# EAGLE design paste_injectorMM (EAGLE 6.5.0)
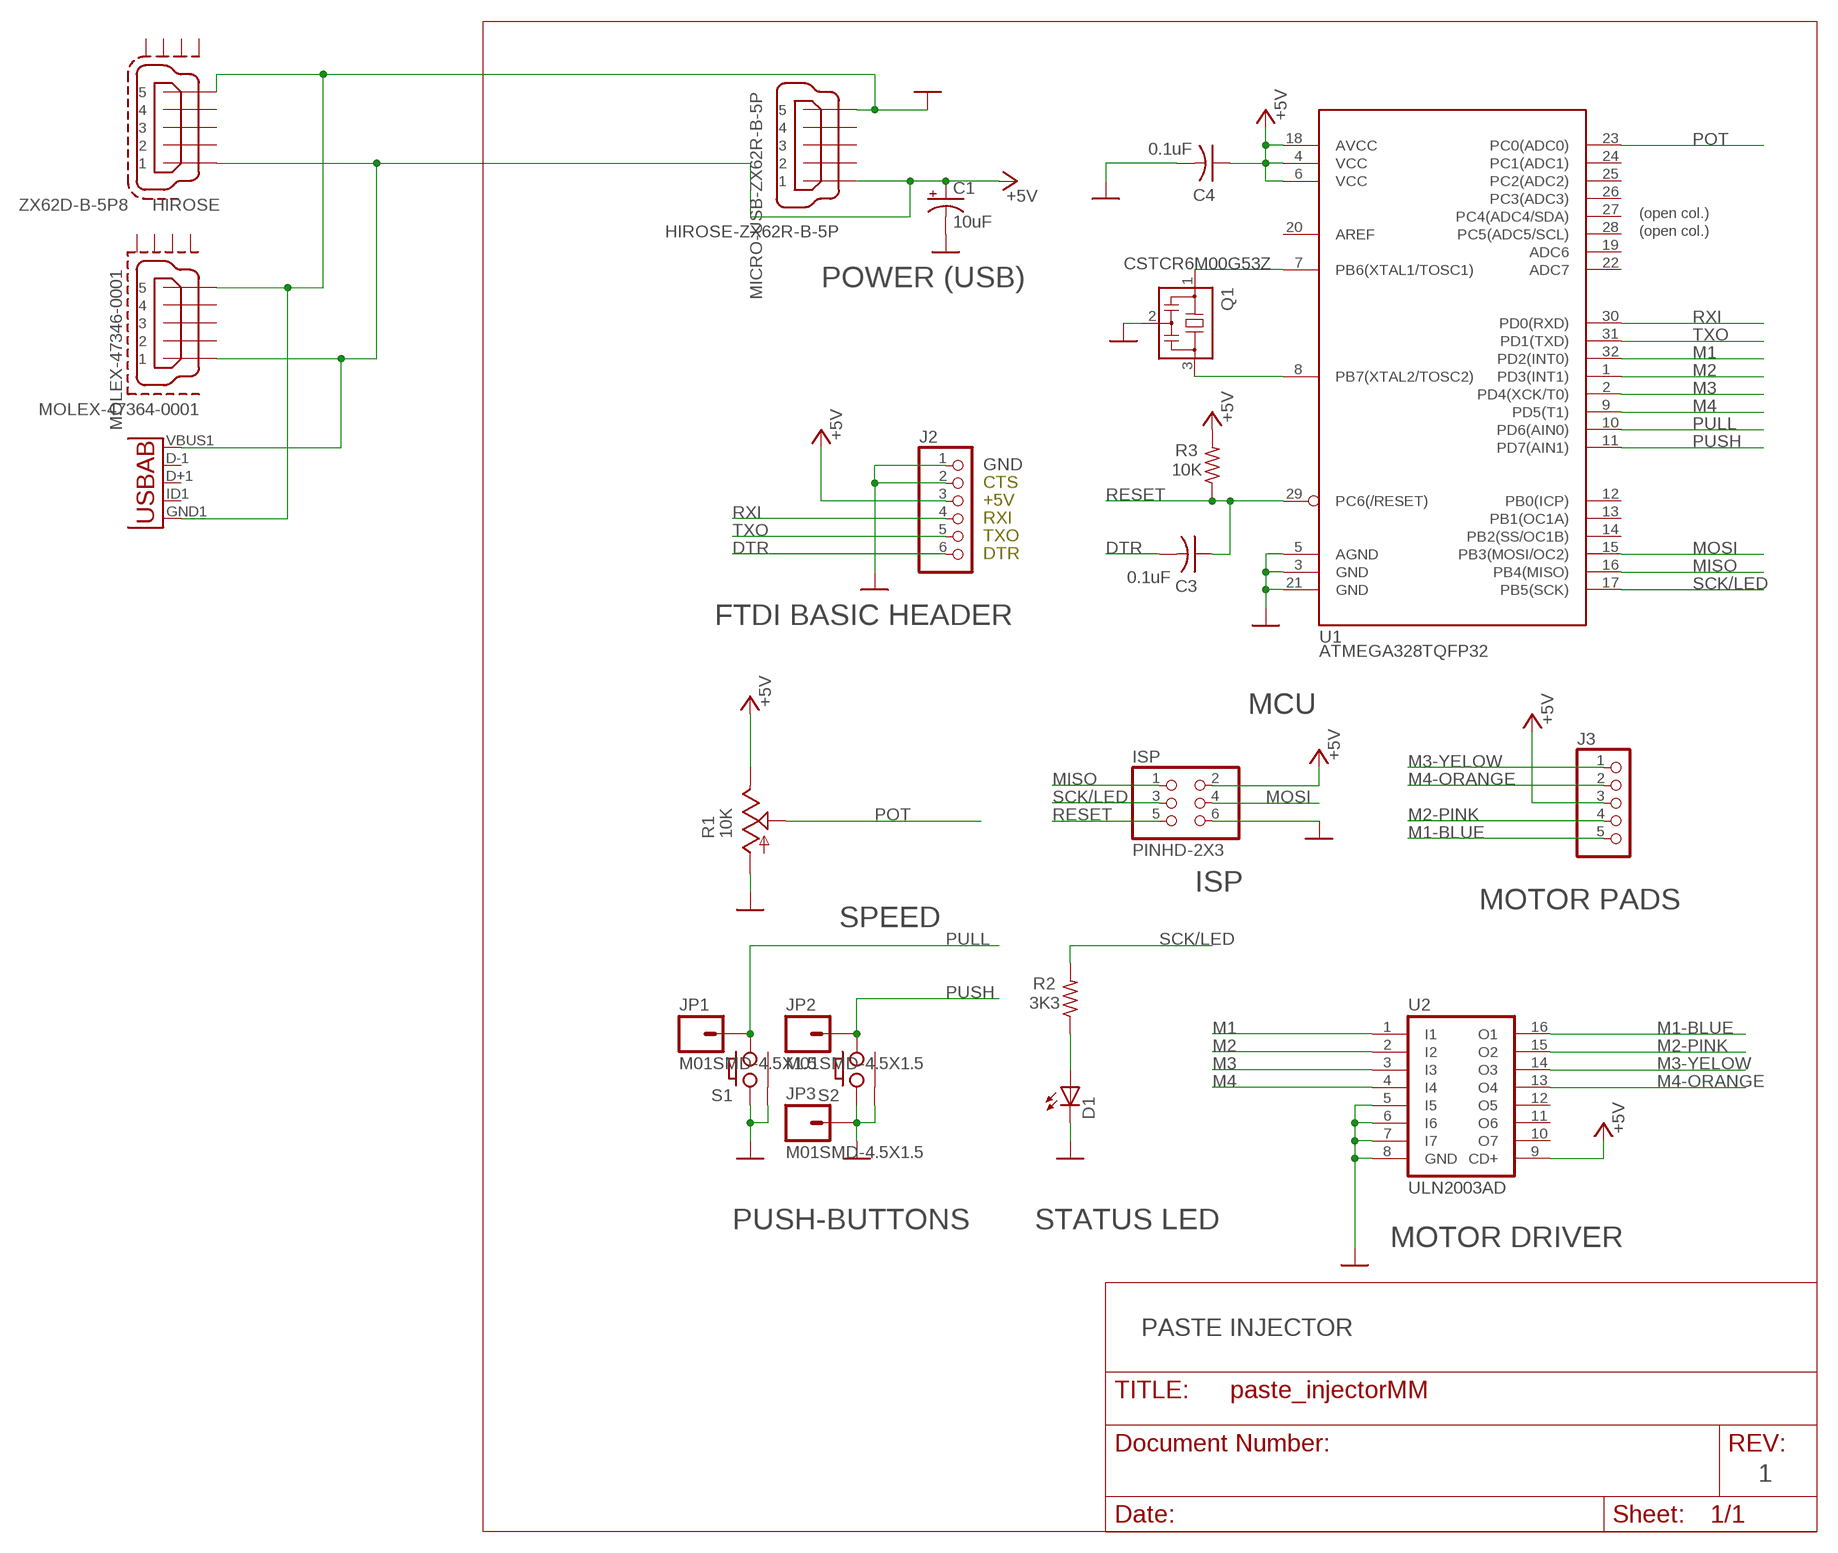
[diagram p0: schematic, sheet 1]

## Parts
C1  10uF  CPOL-USA/3216-18R  [A/3216-18R]
C3  0.1uF  CAP-C0603  [C0603]
C4  0.1uF  CAP-C0603  [C0603]
D1  LED  [LED0603]
HIROSE  ZX62D-B-5P8  [ZX62D-B-5P8]
HIROSE-ZX62R-B-5P  MICRO-USB-ZX62R-B-5P  [ZX62R-B-5P]
ISP  PINHD-2X3  [2X03]
J2  PINHD-1X6  [1X06]
J3  PINHD-1X5  [1X05]
JP1  M01SMD-4.5X1.5  [PAD-1.5X4.5]
JP2  M01SMD-4.5X1.5  [PAD-1.5X4.5]
JP3  M01SMD-4.5X1.5  [PAD-1.5X4.5]
MOLEX-47364-0001  MOLEX-47346-0001  [MOLEX-47364-0001]
Q1  CSTCR6M00G53Z  [CSTCR6M]
R1  10K  TRIMPOTCA9V  [TRIMPOT]
R2  3K3  RES-R0603  [R0603]
R3  10K  RES-R0603  [R0603]
S1  PUSH_BUTTON  [PUSH_BUTTON]
S2  PUSH_BUTTON  [PUSH_BUTTON]
U1  ATMEGA328TQFP32  [TQFP32-08]
U2  ULN2003AD  [SO16]
U$7  USB-AB""  [USB-AB-MICRO-SMD_V02_BOSS]

## Nets
+5V [power]: C1.+ C4.1 HIROSE-ZX62R-B-5P.1 HIROSE.P$1 ISP.2 J2.3 J3.3 MOLEX-47364-0001.1 R1.CW R3.2 U1.4(VCC) U1.6(VCC) U1.18(AVCC) U2.9(CD+) U$7.VBUS1(VBUS)
DTR: C3.2 J2.6
GND [power]: C1.- C4.2 D1.C HIROSE-ZX62R-B-5P.5 HIROSE.P$5 ISP.6 J2.1 J2.2 JP3.P$1 MOLEX-47364-0001.5 Q1.2 R1.CCW S1.A1 S1.GND S2.A1 S2.GND U1.3(GND) U1.5(AGND) U1.21(GND) U2.5(I5) U2.6(I6) U2.7(I7) U2.8(GND) U$7.GND1(GND)
M1: U1.32(PD2(INT0)) U2.1(I1)
M1-BLUE: J3.5 U2.16(O1)
M2: U1.1(PD3(INT1)) U2.2(I2)
M2-PINK: J3.4 U2.15(O2)
M3: U1.2(PD4(XCK/T0)) U2.3(I3)
M3-YELOW: J3.1 U2.14(O3)
M4: U1.9(PD5(T1)) U2.4(I4)
M4-ORANGE: J3.2 U2.13(O4)
MISO: ISP.1 U1.16(PB4(MISO))
MOSI: ISP.4 U1.15(PB3(MOSI/OC2))
N$1: D1.A R2.1
N$2: Q1.1 U1.7(PB6(XTAL1/TOSC1))
N$7: Q1.3 U1.8(PB7(XTAL2/TOSC2))
POT: R1.C U1.23(PC0(ADC0))
PULL: JP1.P$1 S1.B1 U1.10(PD6(AIN0))
PUSH: JP2.P$1 S2.B1 U1.11(PD7(AIN1))
RESET: C3.1 ISP.5 R3.1 U1.29(PC6(/RESET))
RXI: J2.4 U1.30(PD0(RXD))
SCK/LED: ISP.3 R2.2 U1.17(PB5(SCK))
TXO: J2.5 U1.31(PD1(TXD))
Unconnected: HIROSE-ZX62R-B-5P.2 HIROSE-ZX62R-B-5P.3 HIROSE-ZX62R-B-5P.4 HIROSE.P$2 HIROSE.P$3 HIROSE.P$4 HIROSE.SH1 HIROSE.SH2 HIROSE.SH3 HIROSE.SH4 MOLEX-47364-0001.2 MOLEX-47364-0001.3 MOLEX-47364-0001.4 MOLEX-47364-0001.GND1 MOLEX-47364-0001.GND2 MOLEX-47364-0001.GND3 MOLEX-47364-0001.GND4 U1.12(PB0(ICP)) U1.13(PB1(OC1A)) U1.14(PB2(SS/OC1B)) U1.19(ADC6) U1.20(AREF) U1.22(ADC7) U1.24(PC1(ADC1)) U1.25(PC2(ADC2)) U1.26(PC3(ADC3)) U1.27(PC4(ADC4/SDA)) U1.28(PC5(ADC5/SCL)) U2.10(O7) U2.11(O6) U2.12(O5) U$7.D+1(D+) U$7.D-1(D-) U$7.ID1(USBID)

## Notes on the sheet
- (open col.)
- (open col.)
- POWER (USB)
- GND
- CTS
- +5V
- RXI
- TXO
- DTR
- FTDI BASIC HEADER
- MCU
- ISP
- MOTOR PADS
- SPEED
- PUSH-BUTTONS | STATUS LED
- MOTOR DRIVER
- PASTE INJECTOR
- 1

## Library data of the parts
C1 = paste_injector:CPOL-US
C3 C4 = paste_injector:CAP-: CAPACITOR, American symbol
D1 = paste_injector:LED
HIROSE = j_usb_hirose_zx62d-b-5p8:ZX62D-B-5P8: Hirose ZX62D-B-5P8 Micro-B USB connector, standard mount location, with through-hold shell tabs and SMD pins.
HIROSE-ZX62R-B-5P = hirose-con:MICRO-USB-: Hirose Micro USB Connector ZX62R-B-5P: Micro B, reverse (top mount) shell SMT Supplier: DigiKey H11574CT-ND Source: http://www.hirose.co.jp/cataloge_hp/e24200011.pdf
ISP = paste_injector:PINHD-2X3
J2 = paste_injector:PINHD-1X6: PIN HEADER
J3 = paste_injector:PINHD-1X5: PIN HEADER
JP1-JP3 = SparkFun-Connectors:M01: Header 1 Standard 1-pin 0.1" header. Use with straight break away headers (SKU : PRT-00116), right angle break away headers (PRT-00553), swiss pins (PRT-00743), machine pins (PRT-00117), and female headers (PRT-00115).
MOLEX-47364-0001 = usb_con-update:MOLEX-47346-0001: MICRO USB B, BOTTOM MOUNT
Q1 = paste_injector:CSTCR: Resonator Source: murata.co.jp; MPN: CSTCR6M00G53-R0; OC_FARNELL: 1170434; OC_NEWARK: 25M8759
R1 = paste_injector:TRIMPOT: POTENTIOMETER
R2 R3 = paste_injector:RES-: RESISTOR, American symbol
S1 S2 = paste_injector:PUSH_BUTTON
U1 = paste_injector:ATMEGA328
U2 = paste_injector:ULN2003A: DRIVER ARRAY
U$7 = Testing:USB-AB: This is a USB AB connector that is compatible with USB OTG. i.e. this connector can serve as a host or device

## Net classes
1 power: width 0.305 mm

## Board
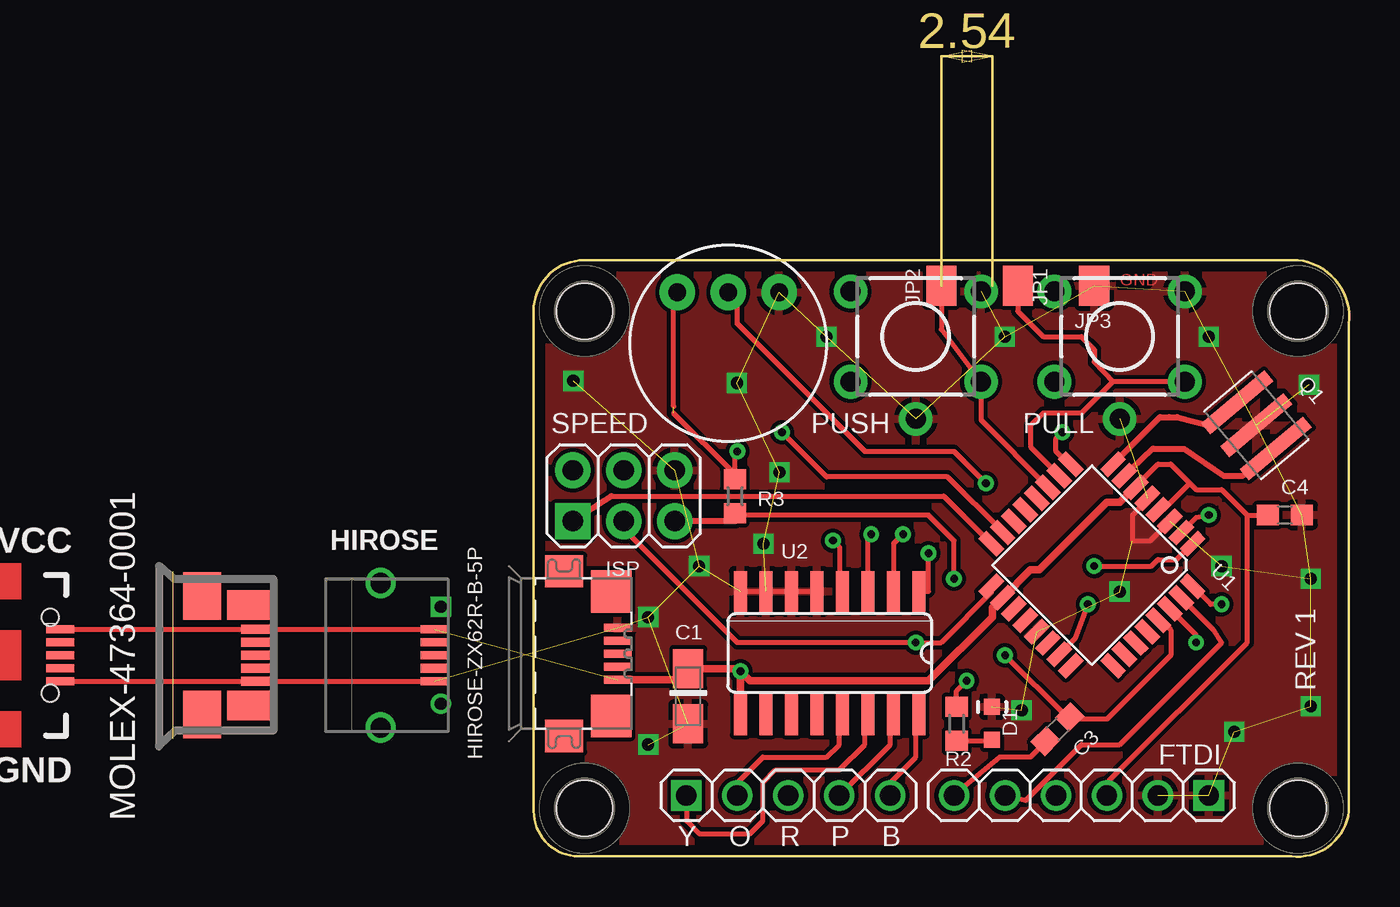
[diagram p1: board, top side]
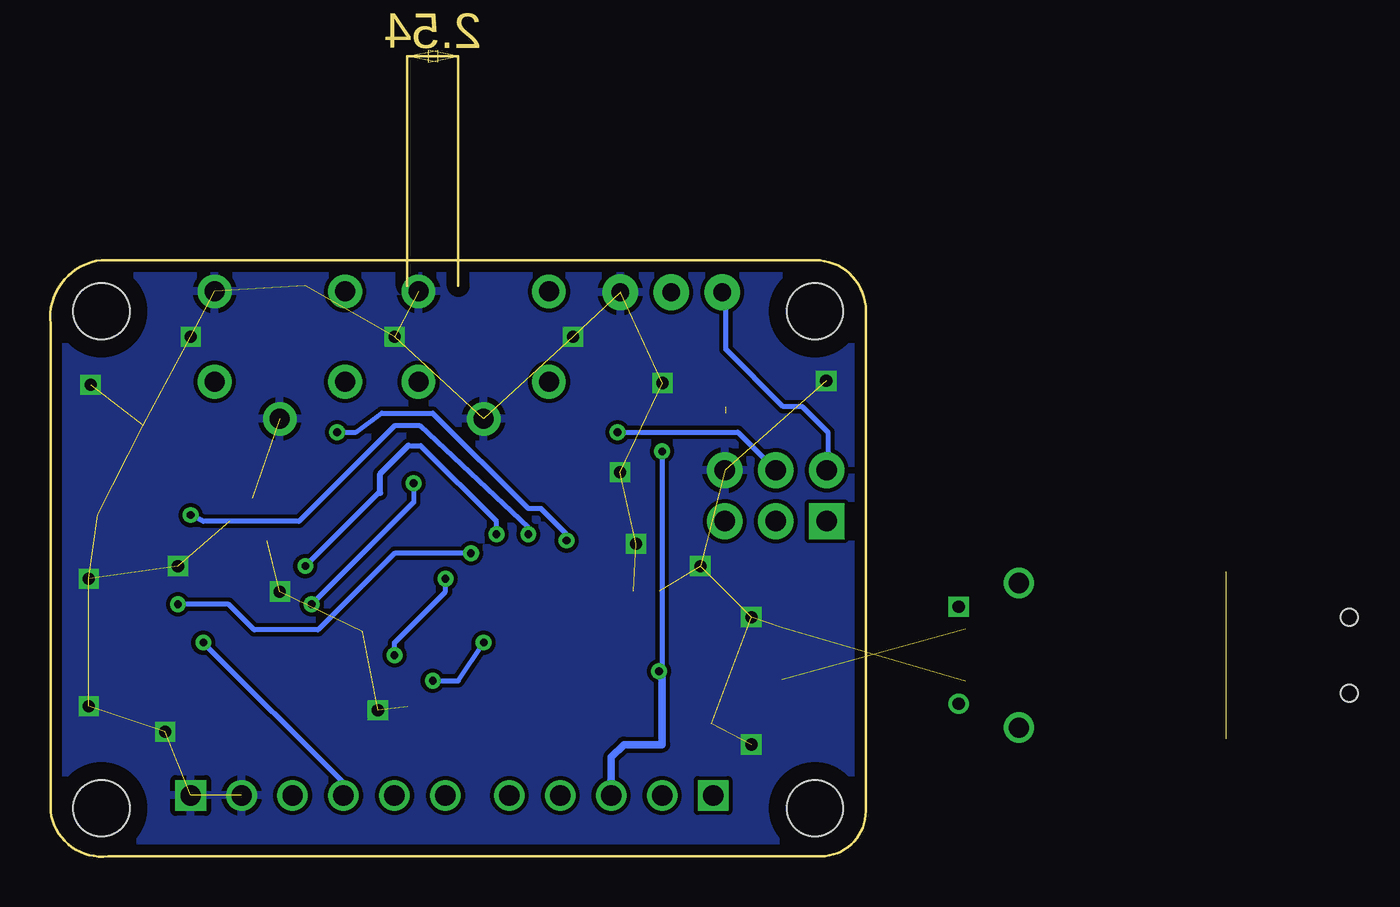
[diagram p2: board, bottom side, seen from below]

Size 40.66 x 29.71 mm. Coordinates in mm from the lower left corner, seen from the top.
Outline: 40.64,2.25 40.64,26.54 arc90 38.1,29.71 2.54,29.71 arc90 0,27.17 0,2.25 arc90 2.24,0.02 37.77,0.02 arc90 40.64,2.25
Copper layers (1*16): Top 0.035mm / dielectric 1.5mm / Bottom 0.035mm
Design rules "default *": minimum track width 10mil, minimum drill 14mil, track to track 8mil, track to pad 8mil, pad to pad 8mil, via to via 8mil, smd to smd 8mil, copper to edge 20mil, drill to drill 8mil, minimum pad ring 7mil, minimum via ring 8mil, stop-mask expansion 4mil, vias tented up to drill 20mil, thermal gap 10mil

### Footprints (pad centres in the part's own frame; a part is rotated, then mirrored left to right if it is on the bottom)
A/3216-18R = smd 1.95 x 1.5: + 1.375,0; - -1.375,0
C0603 = smd 1.1 x 1: 1 -0.85,0; 2 0.85,0
LED0603 = smd 0.8 x 0.8: A 0,-0.825; C 0,0.825
ZX62D-B-5P8 = smd 0.4 x 1.35: P$1 -1.3,2.675; P$2 -0.65,2.675; P$3 0,2.675; P$4 0.65,2.675; P$5 1.3,2.675 | drill 0.6 pad 1 square: SH1 -2.425,3 | drill 0.6 pad 1: SH2 2.425,3 | drill 1 pad 1.4: SH3 -3.6,0; SH4 3.6,0
ZX62R-B-5P = smd 1.35 x 0.4: 1 2.675,-1.3; 2 2.675,-0.65; 3 2.675,0; 4 2.675,0.65; 5 2.675,1.3 | smd 1.9 x 1.6: M1 0,-4.1; M2 0,4.1 | smd 2 x 2.1: M3 2.35,3.1; M4 2.35,-3.1
2X03 = drill 1.016 pad 1.778 square: 1 -2.54,-1.27 | drill 1.016 pad 1.778: 2 -2.54,1.27; 3 0,-1.27; 4 0,1.27; 5 2.54,-1.27; 6 2.54,1.27
1X06 = drill 1.016 square: 1 -6.35,0 | drill 1.016: 2 -3.81,0; 3 -1.27,0; 4 1.27,0; 5 3.81,0; 6 6.35,0
1X05 = drill 1.016 square: 1 -5.08,0 | drill 1.016: 2 -2.54,0; 3 0,0; 4 2.54,0; 5 5.08,0
PAD-1.5X4.5 = smd 1.5 x 2: P$1 0,0
MOLEX-47364-0001 = smd 1.7 x 0.45: 1 2.8,1.3; 2 2.8,0.65; 3 2.8,0; 4 2.8,-0.65; 5 2.8,-1.3 | smd 1.9 x 2.375: GND1 0,2.95; GND4 0,-2.95 | smd 2.1 x 1.475: GND2 2.3,2.5; GND3 2.3,-2.5
CSTCR6M = smd 0.7 x 4.1: 1 -1.5,0; 2 0,0; 3 1.5,0
TRIMPOT = drill 0.889 pad 1.778: C 0,-2.54; CCW -2.54,-2.54; CW 2.54,-2.54
R0603 = smd 1 x 1.1: 1 -0.85,0; 2 0.85,0
PUSH_BUTTON = drill 1 pad 1.676: A1 -2.25,3.25; A2 -2.25,-3.25; B1 2.25,3.25; B2 2.25,-3.25; GND 4.1,0
TQFP32-08 = smd 1.27 x 0.559: 1 -4.293,2.8; 2 -4.293,2; 3 -4.293,1.2; 4 -4.293,0.4; 5 -4.293,-0.4; 6 -4.293,-1.2; 7 -4.293,-2; 8 -4.293,-2.8; 17 4.293,-2.8; 18 4.293,-2; 19 4.293,-1.2; 20 4.293,-0.4; 21 4.293,0.4; 22 4.293,1.2; 23 4.293,2; 24 4.293,2.8 | smd 0.559 x 1.27: 9 -2.8,-4.293; 10 -2,-4.293; 11 -1.2,-4.293; 12 -0.4,-4.293; 13 0.4,-4.293; 14 1.2,-4.293; 15 2,-4.293; 16 2.8,-4.293; 25 2.8,4.293; 26 2,4.293; 27 1.2,4.293; 28 0.4,4.293; 29 -0.4,4.293; 30 -1.2,4.293; 31 -2,4.293; 32 -2.8,4.293
SO16 = smd 0.66 x 2.032: 1 -4.445,-3.073; 2 -3.175,-3.073; 3 -1.905,-3.073; 4 -0.635,-3.073; 5 0.635,-3.073; 6 1.905,-3.073; 7 3.175,-3.073; 8 4.445,-3.073; 9 4.445,3.073; 10 3.175,3.073; 11 1.905,3.073; 12 0.635,3.073; 13 -0.635,3.073; 14 -1.905,3.073; 15 -3.175,3.073; 16 -4.445,3.073
2,8 = hole 2.8: 0,0
USB-AB-MICRO-SMD_V02_BOSS = smd 1.4 x 0.4: D+1 2.7,0; D-1 2.7,0.65; GND1 2.7,-1.3; ID1 2.7,-0.65; VBUS1 2.7,1.3 | hole 0.85: 2.2,1.9; 2.2,-1.9

### Placement (x,y rotation side)
C1  7.71,7.99 90 top
C3  26.12,6.35 225 top
C4  37.44,17.02 0 top
D1  22.85,6.64 0 top
HIROSE  -7.62,10.03 270 top  (outside the outline)
HIROSE-ZX62R-B-5P  1.52,10.11 0 top
ISP  4.5,17.98 0 top
J2  27.31,3.04 180 top
J3  12.7,3.04 0 top
JP1  24.13,28.44 180 top
JP2  20.32,28.44 180 top
JP3  27.94,28.44 180 top
MOLEX-47364-0001  -16.51,10.03 0 top  (outside the outline)
Q1  36.03,21.48 130 top
R1  9.7,25.57 180 top
R2  21.09,6.62 90 top
R3  10.04,17.96 90 top
S1  29.21,25.9 270 top
S2  19.05,25.9 270 top
U1  27.83,14.52 225 top
U2  14.76,10.14 180 top
U$2  [2,8]  2.54,2.41 0 top
U$3  [2,8]  38.1,27.17 0 top
U$4  [2,8]  38.1,2.41 0 top
U$5  [2,8]  2.54,27.17 0 top
U$7  -26.29,10.03 0 top  (outside the outline)

### Tracks (layer width: path | path; a pad name or v marks a point on that pad's centre or on a via)
+5V  (via drill 0.38)  (2 unrouted)
  Top 0.254: 6.98,22.41 6.98,27.94 R1.CW | 10.04,19.04 6.98,22.09 | 29.97,18.41 30.07,18.41 30.07,18.51 31.11,19.55 31.75,19.55 32.7,18.6 | J2.3 28.71,3.81 35.56,10.66 35.56,17.01 | 32.7,18.6 33.02,18.28 34.29,18.28 35.56,17.01 | 35.56,17.01 C4.1 | U1.4 31.38,17.28 32.7,18.6 | 7.15,8.81 C1.+ | R3.2 10.04,19.04 | 10.04,19.04 10.04,20.07 v10.16,20.19 | HIROSE.P$1 MOLEX-47364-0001.1 U$7.VBUS1
  Top 0.305: U1.4 31.15,17.25 | U1.6 30.07,18.41
  Top 0.381: HIROSE-ZX62R-B-5P.1 7.15,8.81 | U2.9 v10.32,9.24 | v10.32,9.24 10.8,8.76 19.68,8.76 22.86,11.93 22.86,12.38 U1.18 24.77,14.29 25.21,14.29 28.57,17.65 29.21,17.65 29.97,18.41 | C1.+ 10.19,9.36 v10.32,9.24
  Bottom 0.254: ISP.2 1.91,19.3 1.91,21.14 3.18,22.41 4.13,22.41 6.98,25.27 6.98,27.94 R1.CW | v10.16,20.19 10.16,9.39 v10.32,9.24
  Bottom 0.381: J3.3 12.7,4.95 12.07,5.58 10.16,5.58 10.16,9.08 v10.32,9.24
DTR
  Top 0.254: C3.2 25.52,5.7 24.77,4.95 23.23,4.95 J2.6
GND  (via drill 0.6, 0.6 pad 0.25)  (34 unrouted)
  Top 0.254: U1.5 30.58,17.75 29.85,17.01 29.85,15.74 30.75,15.74 U1.3 | U2.8 U2.7 U2.6 U2.5 | HIROSE.P$5 MOLEX-47364-0001.5 U$7.GND1
  other vias: 29.21,13.2 24.33,7.3 8.26,14.47 5.71,11.93 1.98,23.69 10.13,23.59 11.47,15.59 12.26,19.15 23.5,25.9 14.61,25.9 33.66,25.9 38.65,23.51 5.71,5.58 33.66,25.9 38.73,13.84 38.73,7.49 34.92,6.22 34.29,14.47
  pour Bottom: 41.28,31.29 41.28,-0.59 -0.13,-0.59 -0.13,31.29
  pour Top: -0.63,30.6 -0.63,-0.84 40.77,-0.84 40.77,30.6 -0.61,30.6
M1  (via drill 0.38)
  Top 0.254: U2.1 19.68,13.21 v19.68,15.11 | v34.29,12.57 33.75,12.57 U1.32
  Bottom 0.254: v19.68,15.11 23.5,15.11 27.31,11.3 30.48,11.3 31.75,12.57 v34.29,12.57
M1-BLUE
  Top 0.254: J3.5 17.78,3.68 19.05,4.95 19.05,6.9 U2.16
M2  (via drill 0.38)
  Top 0.254: v27.94,14.47 30.8,14.47 31.11,14.79 32.07,14.79 32.07,14.8 U1.1 | 17.96,12.58 17.96,15.6 v18.41,16.06
  Top 0.305: 17.96,12.58 17.93,12.58 U2.2
  Bottom 0.254: 22.81,20.47 22.19,20.47 18.41,16.7 v18.41,16.06 | 24.21,18.11 24.31,18.11 v27.94,14.47
  Bottom 0.305: 24.21,18.11 24.21,19.07 22.81,20.47
M2-PINK
  Top 0.254: J3.4 17.78,5.58 17.78,6.9 U2.15
M3  (via drill 0.38)
  Top 0.254: U2.3 16.67,15.9 v16.83,16.06 | v33.66,17.01 33.02,16.89 U1.2
  Bottom 0.254: v16.83,16.06 16.83,16.38 22.23,21.46 23.5,21.46 28.26,16.7 33.02,16.7 v33.66,17.01
M3-YELOW
  Top 0.254: J3.1 7.62,1.77 8.26,1.14 10.8,1.14 11.43,1.77 11.43,3.68 12.07,4.31 15.24,4.31 16.51,5.58 16.51,6.9 U2.14
M4  (via drill 0.38)
  Top 0.254: U1.9 26.68,19.54 26.04,20.19 26.04,20.82 v26.35,21.14 | v14.92,15.74 15.24,15.43 15.24,13.37 U2.4
  Bottom 0.254: v26.35,21.14 25.4,21.14 24.13,22.09 21.59,22.09 16.83,17.33 16.19,17.33 14.92,16.06 v14.92,15.74
M4-ORANGE
  Top 0.254: J3.2 10.16,3.68 11.43,4.95 14.61,4.95 15.24,5.58 15.24,6.9 U2.13
MISO
  Top 0.254: 3.89,17.95 20.44,17.95 U1.16
  Top 0.305: U1.16 22.8,15.58 | 3.89,17.95 ISP.1
MOSI  (via drill 0.38)
  Top 0.254: U1.15 23.38,16.18 20.64,18.92 14.61,18.92 v12.38,21.14
  Bottom 0.254: v12.38,21.14 6.39,21.14 ISP.4
  Bottom 0.305: ISP.4 4.5,19.07
N$1
  Top 0.254: R2.1 22.81,5.77 D1.A
  Top 0.305: D1.A 23.09,5.81
N$2
  Top 0.305: U1.7 29.6,18.97 29.32,18.84 30.88,20.33 32.43,20.31 34.41,18.97 35.37,18.98 36.01,19.56 Q1.1
N$7
  Top 0.305: U1.8 28.89,19.56 31.22,21.89 31.67,21.89 32.08,21.89 33.83,21.44 Q1.3
POT  (via drill 0.38)
  Top 0.254: 9.7,27.95 R1.C 10.16,27.66 10.16,26.54 16.51,20.19 20.96,20.19 v22.54,18.6 | v27.62,12.57 26.99,10.85 U1.23
  Bottom 0.254: v22.54,18.6 22.54,17.65 v27.62,12.57
PULL
  Top 0.254: S1.B1 28.86,23.65 | 28.86,23.65 27.31,22.09 25.4,22.09 24.77,21.46 24.77,20.42 U1.10 | JP1.P$1 24.13,27.17 25.4,25.9 27.31,25.9 27.94,25.27 27.94,24.63 28.86,23.65
PUSH
  Top 0.254: U1.11 22.3,21.75 S2.B1 20.32,26.27 JP2.P$1
RESET  (via drill 0.38)
  Top 0.254: U1.29 31.28,11.77 31.75,11.3 31.75,10.03 28.57,6.85 26.82,6.85 C3.1 26.57,6.95 v23.5,10.03 | v20.96,13.84 20.96,15.74 19.68,17.01 10.13,17.01 R3.1
  Top 0.305: R3.1 10.04,16.75 10.08,16.71 ISP.5
  Bottom 0.254: v23.5,10.03 23.5,10.66 20.96,13.2 v20.96,13.84
RXI  (via drill 0.38)
  Top 0.254: v33.02,10.66 33.02,11.03 U1.30
  Bottom 0.254: 26.17,3.18 J2.4 26.04,3.68 v33.02,10.66
SCK/LED  (via drill 0.38)
  Top 0.254: U1.17 22.81,13.16 20.32,10.66 v19.05,10.66 10.16,10.66 4.45,16.38 4.45,16.66 ISP.3 | R2.2 21.09,8.26 v21.59,8.76
  Bottom 0.254: v21.59,8.76 20.32,8.76 v19.05,10.66
TXO
  Top 0.254: J2.5 24.53,2.81 27.31,5.58 29.21,5.58 34.29,10.66 33.88,11.3 U1.31

### Text on the board
Top: GND
tPlace: SPEED | PUSH | PULL | VCC | REV 1 | Micro USB | GND | FTDI | Y | O | R | P | B